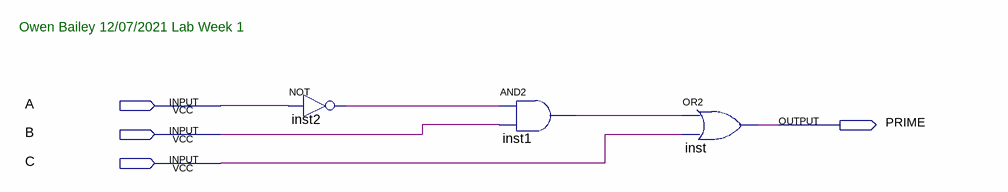
[diagram p0: schematic sheet]
// Quartus schematic prime.bdf as structural Verilog: 3 symbols, 4 pins
module prime (
  input  A,
  input  B,
  input  C,
  output PRIME
);

  wire inst1_out, inst2_out;

  not inst2 (inst2_out, A);
  and inst1 (inst1_out, inst2_out, B);
  or inst (PRIME, inst1_out, C);

  // Notes on the sheet:
  //   Owen Bailey 12/07/2021 Lab Week 1
endmodule
